# EasyEDA schematic SCH_esp32car_2026-05-05.json
TITLE: esp32_solar_motor_car; REV: 1.0; Date: 2026-05-05; Sheet: 1/1; Company: MUFASA
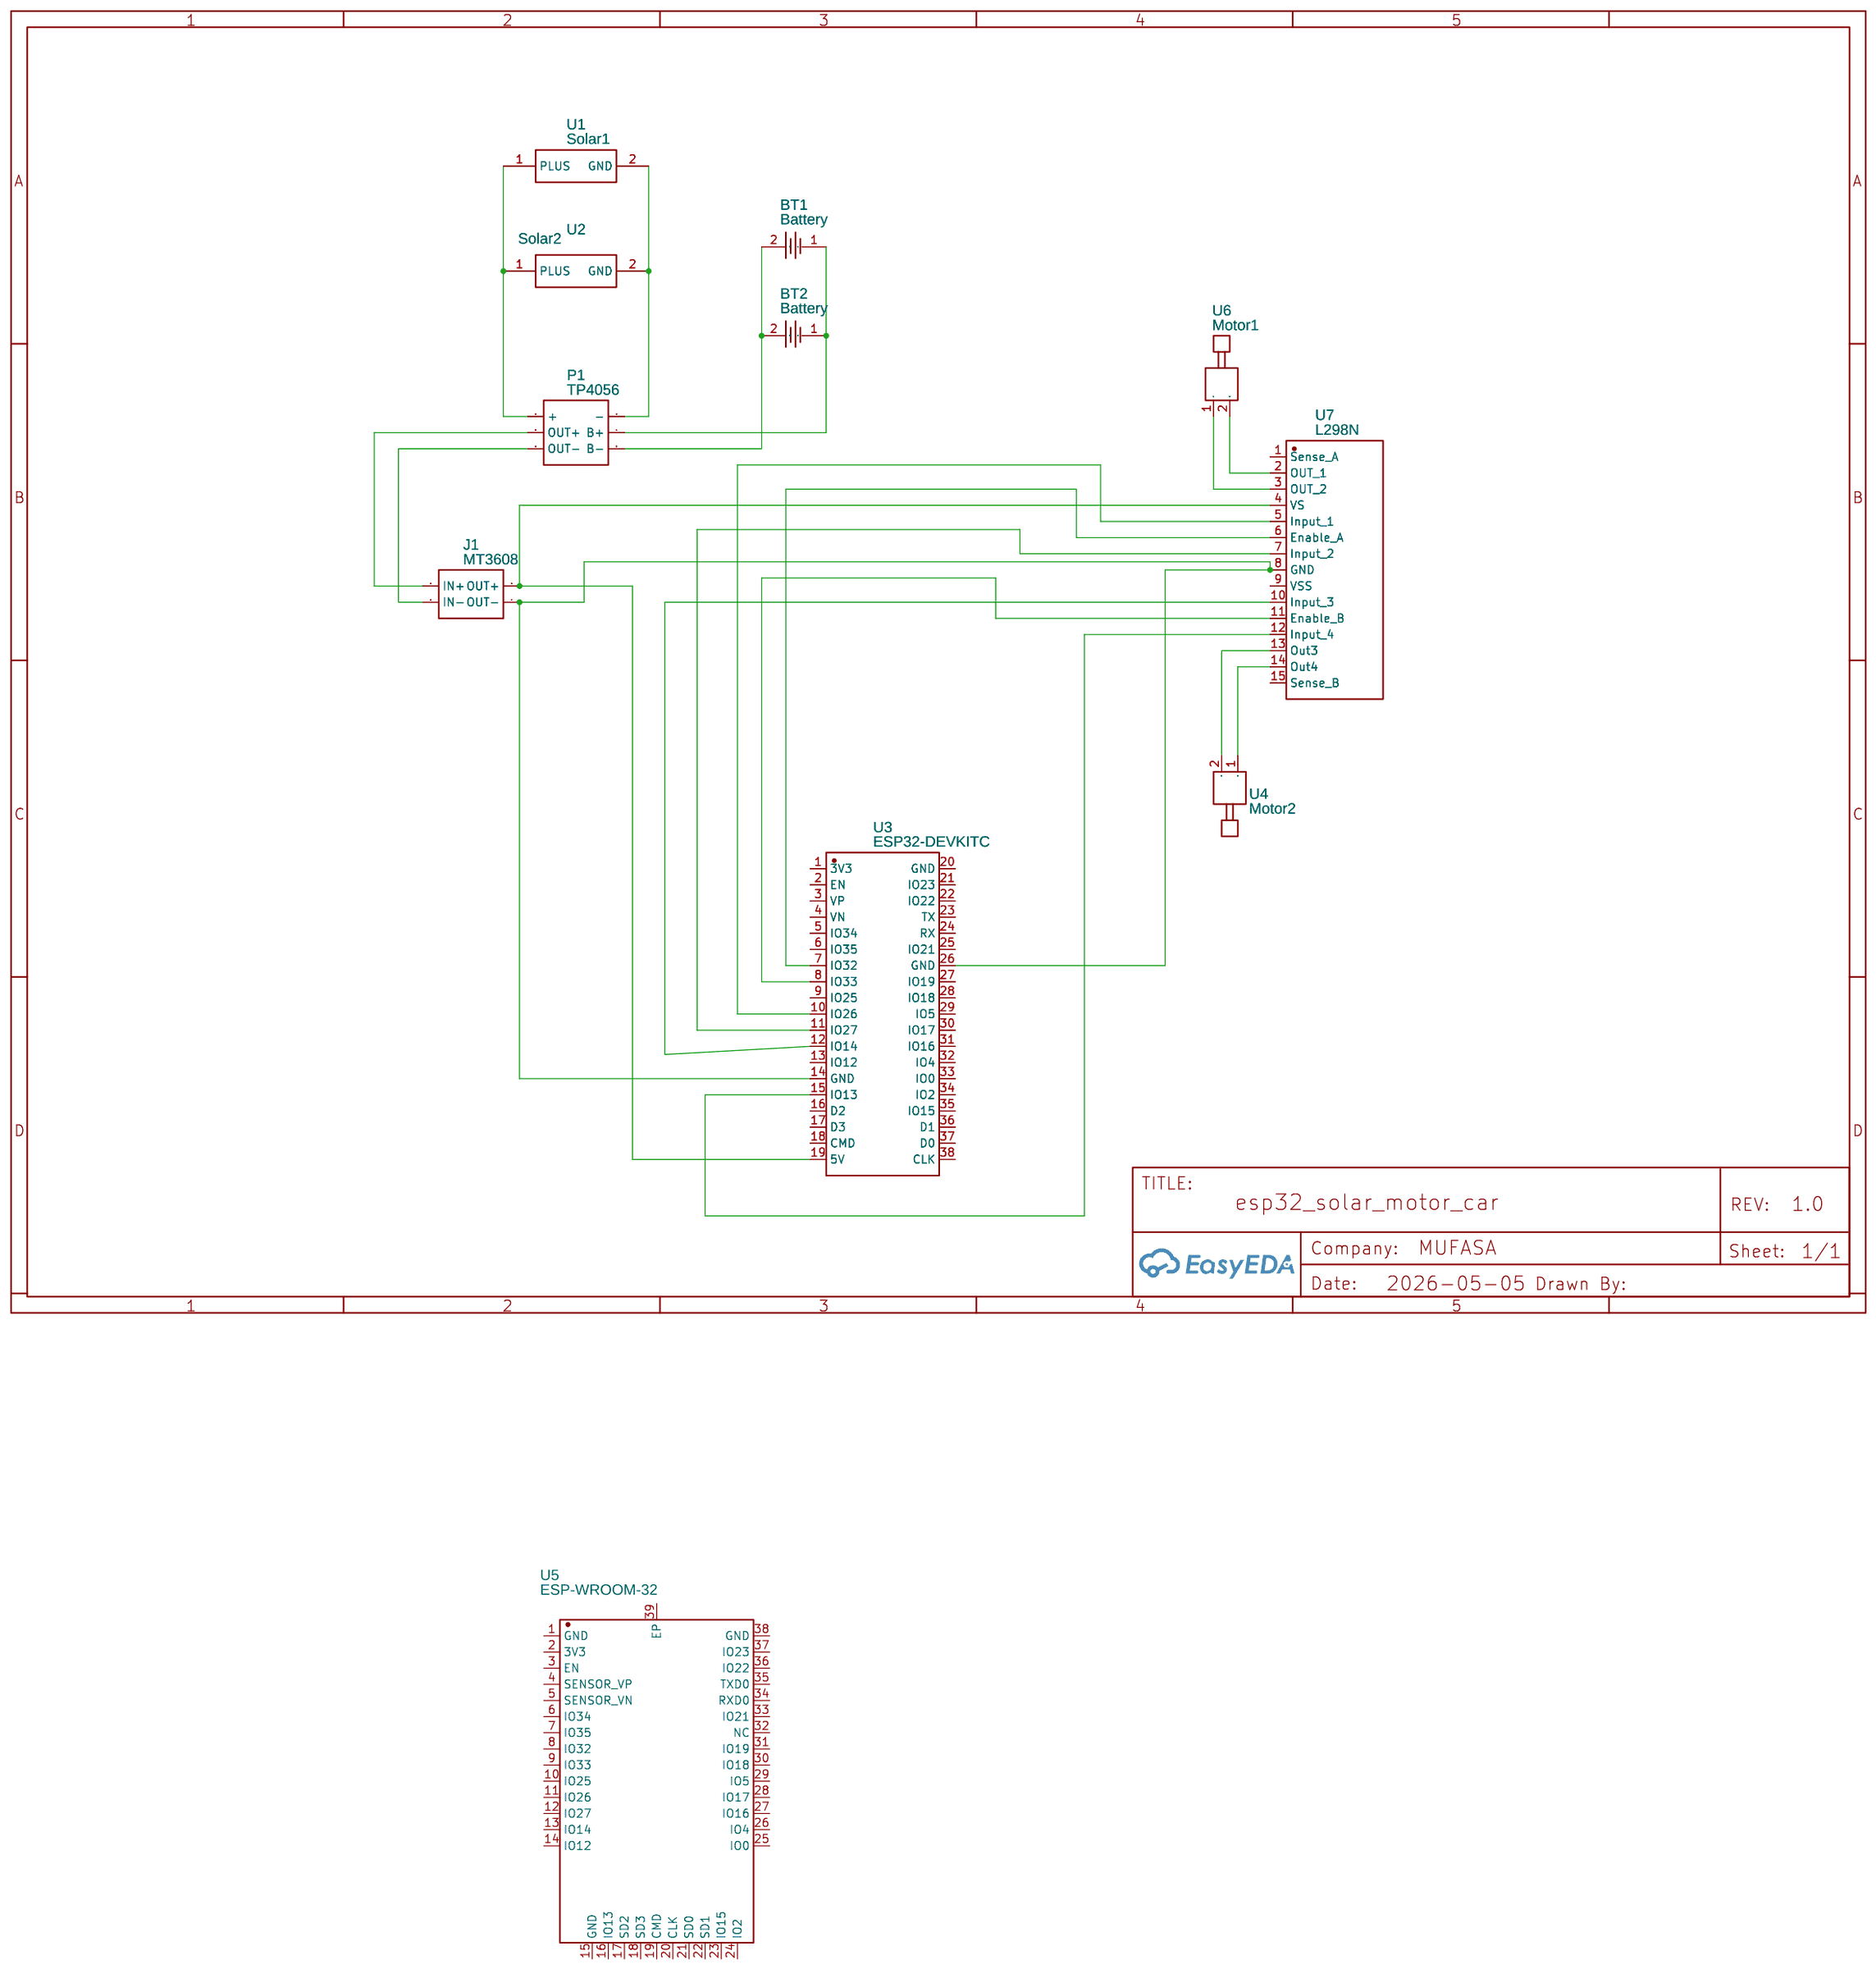
[diagram p0: schematic sheet]

## Parts
BT1  Battery  [BATTERY-SMD_18650-1S-L77.1-W20.7-1]
BT2  Battery  [BATTERY-SMD_18650-1S-L77.1-W20.7-1]
J1  MT3608  [HDR-M-2.54_2X2]
P1  TP4056  [IDC-TH_6P-P2.54_C11214]
U1  Solar1  [SOLAR_PANEL]
U2  Solar2  [SOLAR_PANEL]
U3  ESP32-DEVKITC  [BULETM-SMD_ESP32-DEVKITC]
U4  Motor2  [MOTOR_LCM04084521-B1]
U5  ESP-WROOM-32  [WIFIM-SMD_ESP-WROOM-32]
U6  Motor1  [MOTOR_LCM04084521-B1]
U7  L298N  [MULTIWATT-15_L19.6-W5.0-P1.27-L]

## Library data of the parts
BT1 BT2 = BH-18650-B1BA002: Contributor: lcsc; Supplier: LCSC; Supplier Part: C2988620; Manufacturer: MYOUNG(美阳); JLCPCB Part Class: Extended Part
J1 = HDR-M-2.54_2x2: Supplier Part: C66690; Supplier: LCSC; Contributor: LCEDA_Lib; Package Display: No
P1 = HDR-IDC-2.54-2X3P: Supplier: LCSC; Manufacturer: BOOMELE; Manufacturer Part: 2X3 2.54mm IDC Box; image: //image.lceda.cn/szlcsc/C11214.jpg; Supplier Part: C11214
U1 U2 = KXOB25-01X8F-TB: Supplier: Digi-Key; Contributor: klaslofstedt
U3 = ESP32-DEVKITC: Supplier: LCSC; Supplier Part: C571180; Manufacturer: ESPRESSIF(乐鑫); Manufacturer Part: ESP32-DevKitC; Contributor: lcsc
U4 U6 = LCM04084521-B1: Supplier: LCSC; Supplier Part: C2992359; Manufacturer: LEADER(立得); JLCPCB Part Class: Extended Part; Contributor: lcsc
U5 = ESP-WROOM-32: Supplier: LCSC; Manufacturer: ESPRESSIF(乐鑫); Manufacturer Part: ESP32-WROOM-32; Supplier Part: C95209; JLCPCB Part Class: Extended Part
U7 = L298N: Contributor: LCSC; Supplier: LCSC; Supplier Part: C434589; Manufacturer: HGSEMI(华冠); JLCPCB Part Class: Extended Part

## Nets
Net-(BT1-1): BT1.1 BT2.1 P1.4(B+)
Net-(BT1-2): BT1.2 BT2.2 P1.6(B-)
Net-(J1-1): J1.1(IN+) P1.3(OUT+)
Net-(J1-2): J1.2(OUT+) U3.19(5V) U7.4(VS)
Net-(J1-3): J1.3(IN-) P1.5(OUT-)
Net-(J1-4): J1.4(OUT-) U3.14(GND) U3.26(GND) U7.8(GND)
Net-(P1-1): P1.1(+) U1.1(PLUS) U2.1(PLUS)
Net-(P1-2): P1.2(-) U1.2(GND) U2.2(GND)
Net-(U3-7): U3.7(IO32) U7.6(Enable A)
Net-(U3-8): U3.8(IO33) U7.11(Enable B)
Net-(U3-10): U3.10(IO26) U7.5(Input 1)
Net-(U3-11): U3.11(IO27) U7.7(Input 2)
Net-(U3-12): U3.12(IO14) U7.10(Input 3)
Net-(U3-15): U3.15(IO13) U7.12(Input 4)
Net-(U4-1): U4.1 U7.14(Out4)
Net-(U4-2): U4.2 U7.13(Out3)
Net-(U6-1): U6.1 U7.3(OUT 2)
Net-(U6-2): U6.2 U7.2(OUT 1)

Not connected (* = marked no-connect by the designer): U3 1(3V3) 2(EN) 3(VP) 4(VN) 5(IO34) 6(IO35) 9(IO25) 13(IO12) 16(D2) 17(D3) 18(CMD) 20(GND) 21(IO23) 22(IO22) 23(TX) 24(RX) 25(IO21) 27(IO19) 28(IO18) 29(IO5) 30(IO17) 31(IO16) 32(IO4) 33(IO0) 34(IO2) 35(IO15) 36(D1) 37(D0) 38(CLK); U5 1(GND) 2(3V3) 3(EN) 4(SENSOR_VP) 5(SENSOR_VN) 6(IO34) 7(IO35) 8(IO32) 9(IO33) 10(IO25) 11(IO26) 12(IO27) 13(IO14) 14(IO12) 15(GND) 16(IO13) 17(SD2) 18(SD3) 19(CMD) 20(CLK) 21(SD0) 22(SD1) 23(IO15) 24(IO2) 25(IO0) 26(IO4) 27(IO16) 28(IO17) 29(IO5) 30(IO18) 31(IO19) 32(NC) 33(IO21) 34(RXD0) 35(TXD0) 36(IO22) 37(IO23) 38(GND) 39(EP); U7 1(Sense A) 9(VSS) 15(Sense B)
